# Altium schematic sheet TELM0002ADC_BCR.SchDoc: MAX127 Telemetry Circuit
size A3; Engineer: A. SHAW; Organization: BLUEsat Project; Address1: Room 419; Address2: School of EE&T; Address3: UNSW, NSW 2052; Address4: Australia; DocumentNumber: TELM0002; SheetNumber: 1; SheetTotal: 1; Description: Telemetry ADC Circuit; Version: 1.0
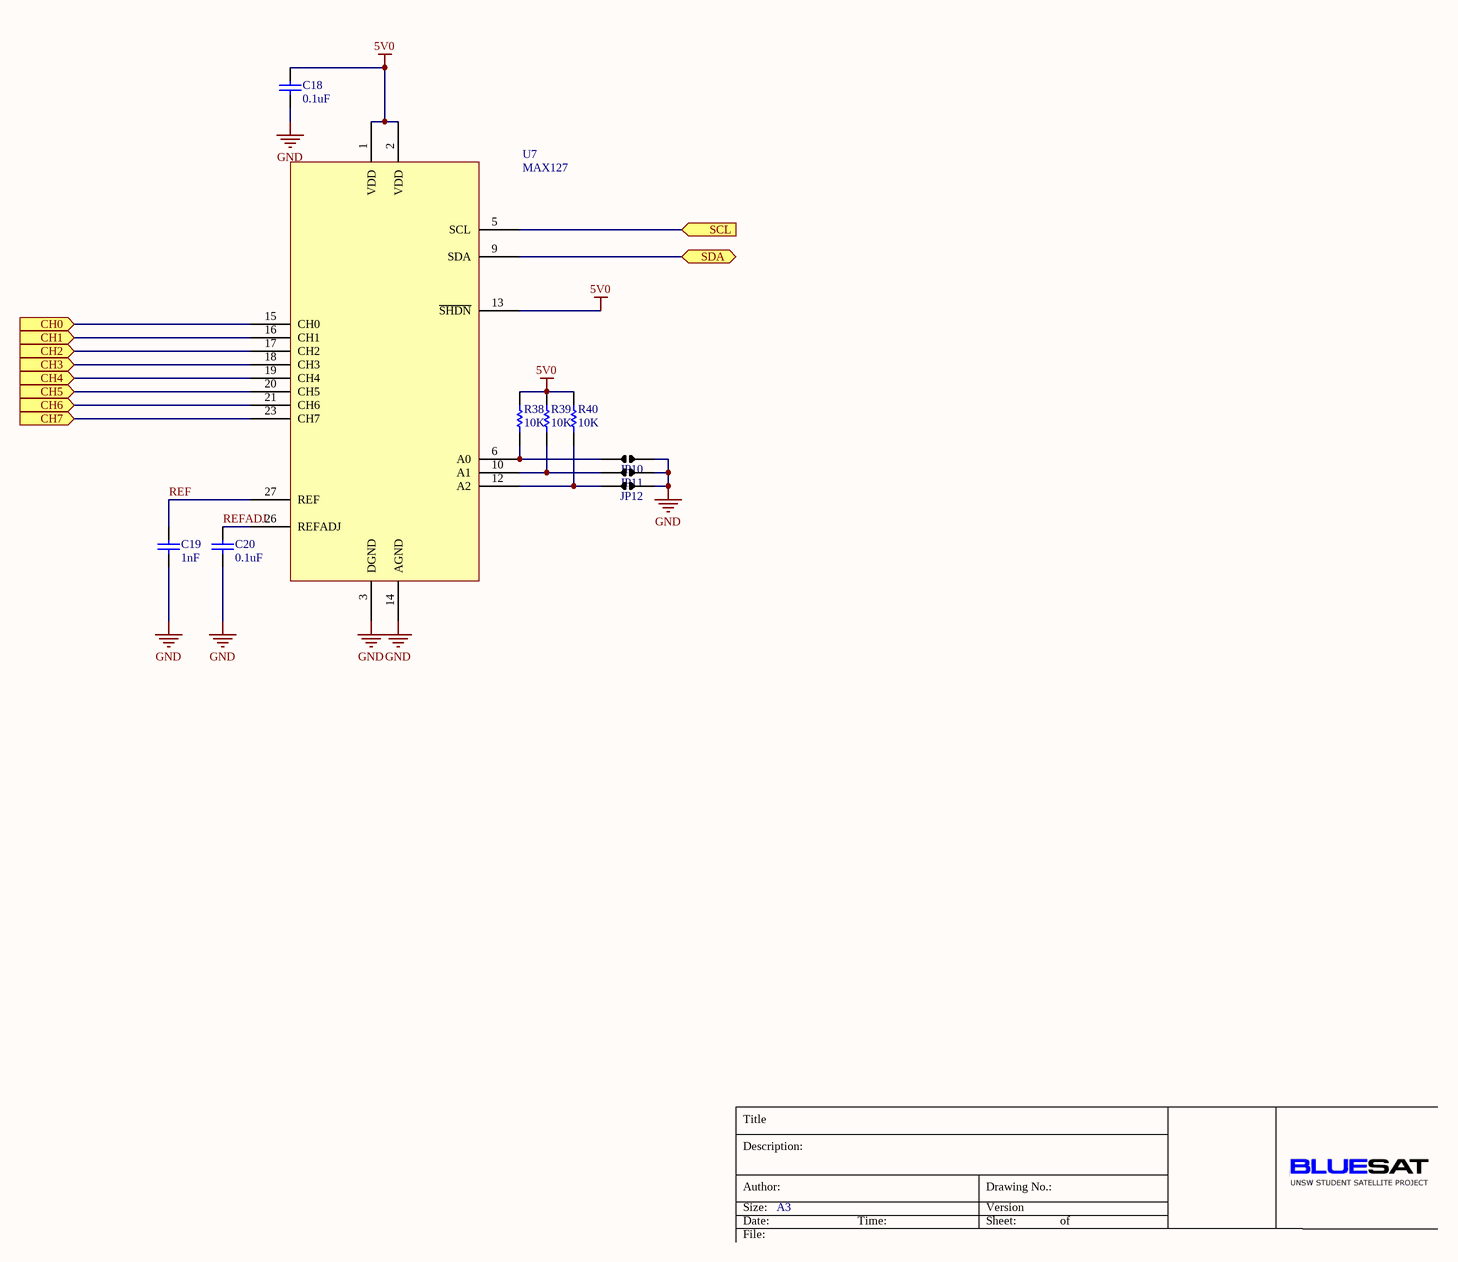
[diagram p0: TELM0002ADC_BCR.SchDoc]

## Parts
C18  value 0.1uF  [CAPC2012M]  (hidden comment: Cap)
C19  value 1nF  [CAPC2012M]  (hidden comment: Cap)
C20  value 0.1uF  [CAPC2012M]  (hidden comment: Cap)
JP10  Jumper  [Solder Jumper C]  (value not drawn)
JP11  Jumper  [Solder Jumper C]  (value not drawn)
JP12  Jumper  [Solder Jumper C]  (value not drawn)
R38  value 10K  [RESC2012M]  (hidden comment: 0805 Resistor)
R39  value 10K  [RESC2012M]  (hidden comment: 0805 Resistor)
R40  value 10K  [RESC2012M]  (hidden comment: 0805 Resistor)
U7  MAX127  [SSOP28 - MAX127]

## Ports
CH0 (in), CH1 (in), CH2 (in), CH3 (in), CH4 (in), CH5 (in), CH6 (in), CH7 (in), SCL (in), SDA (bidir)

## Nets
5V0: C18.1 R38.1 R39.1 R40.1 U7.1(VDD) U7.2(VDD) U7.13(~{SHDN})
GND: C18.2 C19.2 C20.2 JP10.2 JP11.2 JP12.2 U7.3(DGND) U7.14(AGND)
CH0: U7.15(CH0) ; port CH0
CH1: U7.16(CH1) ; port CH1
CH2: U7.17(CH2) ; port CH2
CH3: U7.18(CH3) ; port CH3
CH4: U7.19(CH4) ; port CH4
CH5: U7.20(CH5) ; port CH5
CH6: U7.21(CH6) ; port CH6
CH7: U7.23(CH7) ; port CH7
REF: C19.1 U7.27(REF)
REFADJ: C20.1 U7.26(REFADJ)
SCL: U7.5(SCL) ; port SCL
SDA: U7.9(SDA) ; port SDA
NetJP10_1: JP10.1 R38.2 U7.6(A0)
NetJP11_1: JP11.1 R39.2 U7.10(A1)
NetJP12_1: JP12.1 R40.2 U7.12(A2)

## Notes on the sheet
- Title
- Description:
- Size:
- Author:
- Date:
- A3
- Time:
- Version
- Sheet:
- Drawing No.:
- of
- File:

## Library data of the parts
C18-C20 = Cap: Capacitor; Published: 8-Jun-2000; LatestRevisionDate: 17-Jul-2002; LatestRevisionNote: Re-released for DXP Platform.; PackageReference: RAD-0.3; Publisher: Altium Limited; PackageDescription: Radial Cap, Thru-Hole; 2 Leads; 0.3 in Pin Spacing; Supplier 1: Farnell; Supplier 2: Farnell; Supplier Part Number 2: 1759265
JP10-JP12 = Solder Bridge
R38-R40 = Res1: Resistor; Published: 8-Jun-2000; LatestRevisionDate: 17-Jul-2002; LatestRevisionNote: Re-released for DXP Platform.; PackageReference: AXIAL-0.3; Publisher: Altium Limited; PackageDescription: Axial Device, Thru-Hole; 2 Leads; 0.3 in Pin Spacing; Supplier 1: Farnell
U7 = MAX127: 8 Channel, 12 bit, I2C DAS